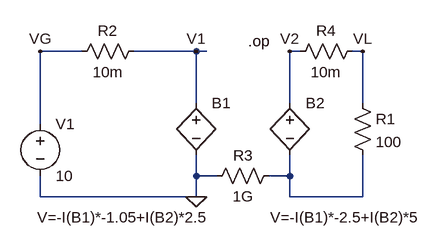
[diagram p0: schematic test.asc]
test.asc, the LTspice schematic file:
Version 4
SHEET 1 880 680
WIRE -32 48 -96 48
WIRE 144 48 48 48
WIRE 160 48 144 48
WIRE 304 48 288 48
WIRE 400 48 384 48
WIRE 144 128 144 48
WIRE 288 128 288 48
WIRE 400 128 400 48
WIRE -96 160 -96 48
WIRE 144 240 144 208
WIRE 176 240 144 240
WIRE 288 240 288 208
WIRE 288 240 256 240
WIRE -96 272 -96 240
WIRE 144 272 144 240
WIRE 144 272 -96 272
WIRE 288 272 288 240
WIRE 400 272 400 208
WIRE 400 272 288 272
FLAG 144 272 0
FLAG 144 48 V1
FLAG 288 48 V2
FLAG -96 48 VG
FLAG 400 48 VL
SYMBOL bv 144 112 R0
WINDOW 3 -245 192 Left 2
SYMATTR InstName B1
SYMATTR Value V=-I(B1)*-1.05+I(B2)*2.5
SYMBOL res 384 112 R0
SYMATTR InstName R1
SYMATTR Value 100
SYMBOL voltage -96 144 R0
WINDOW 123 0 0 Left 0
WINDOW 39 0 0 Left 0
SYMATTR InstName V1
SYMATTR Value 10
SYMBOL bv 288 112 R0
WINDOW 3 -30 192 Left 2
SYMATTR InstName B2
SYMATTR Value V=-I(B1)*-2.5+I(B2)*5
SYMBOL res 64 32 R90
WINDOW 0 0 56 VBottom 2
WINDOW 3 32 56 VTop 2
SYMATTR InstName R2
SYMATTR Value 10m
SYMBOL res 272 224 R90
WINDOW 0 0 56 VBottom 2
WINDOW 3 32 56 VTop 2
SYMATTR InstName R3
SYMATTR Value 1G
SYMBOL res 400 32 R90
WINDOW 0 0 56 VBottom 2
WINDOW 3 32 56 VTop 2
SYMATTR InstName R4
SYMATTR Value 10m
TEXT 224 32 Left 2 !.op

The netlist it stands for:
* test.asc
B1 V1 0 V=-I(B1)*-1.05+I(B2)*2.5
R1 VL N001 100
V1 VG 0 10
B2 V2 N001 V=-I(B1)*-2.5+I(B2)*5
R2 V1 VG 10m
R3 N001 0 1G
R4 VL V2 10m
.op
.backanno
.end